# EAGLE design main (EAGLE 9.6.2)
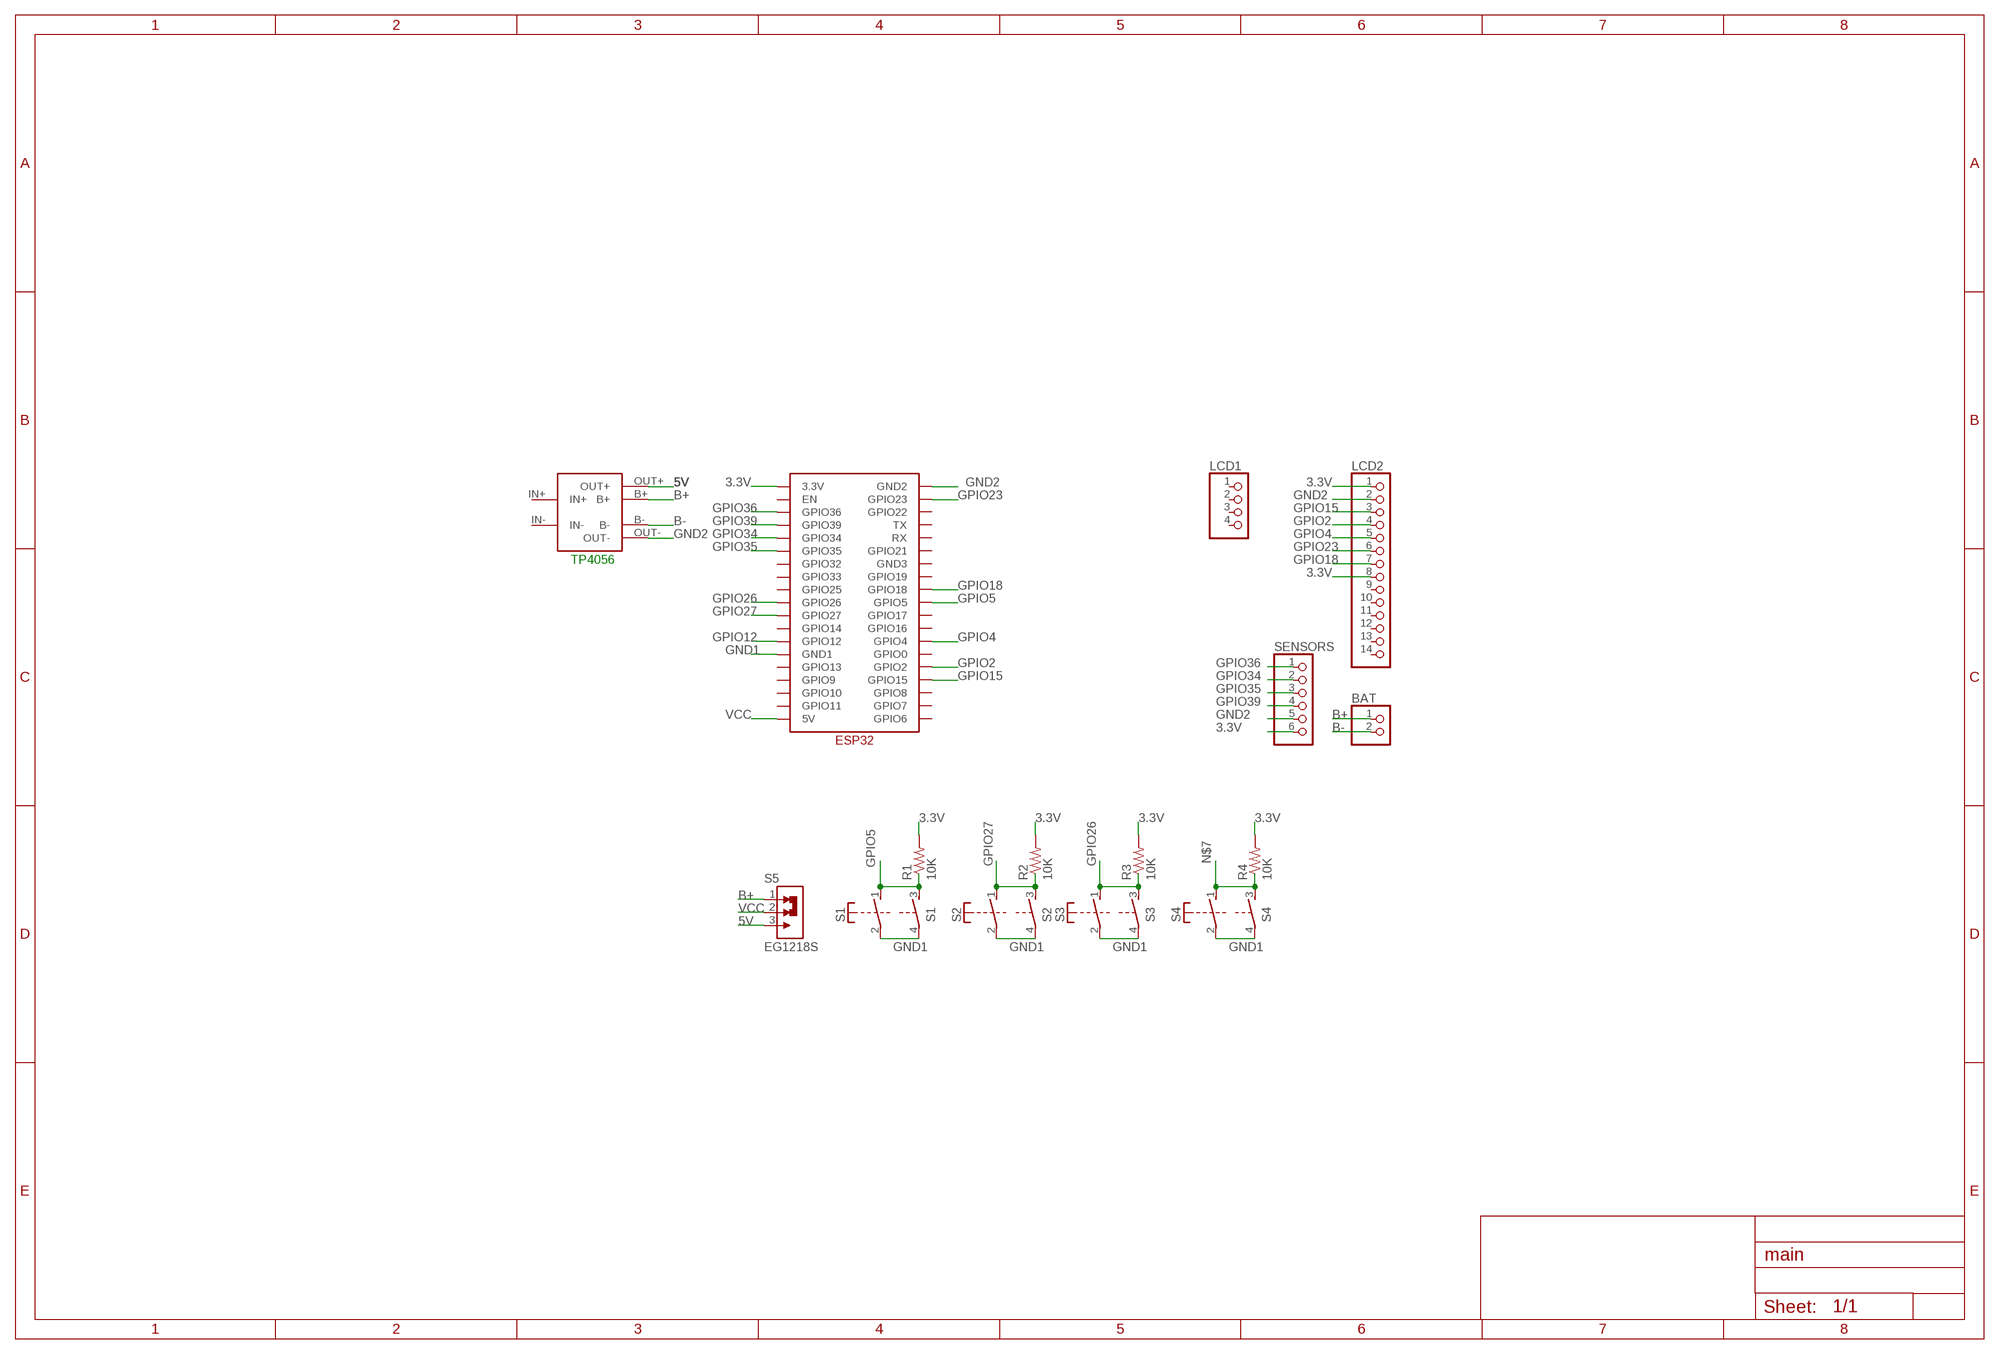
[diagram p0: schematic, sheet 1]

## Parts
BAT  PINHD-1X2  [1X02]
LCD1  PINHD-1X4  [1X04]
LCD2  PINHD-1X14  [1X14]
R1  10K  R-US_R0603  [R0603]
R2  10K  R-US_R0603  [R0603]
R3  10K  R-US_R0603  [R0603]
R4  10K  R-US_R0603  [R0603]
S1  PVA1  [PVA1F]
S2  PVA1  [PVA1F]
S3  PVA1  [PVA1F]
S4  PVA1  [PVA1F]
S5  EG1218S  [SW_EG1218]
SENSORS  PINHD-1X6  [1X06]
U$1  TP4056-PTH  [TP4056-PTH]
U$2  ESP32  [ESP32]

## Nets
3.3V: LCD2.1 LCD2.8 R1.2 R2.2 R3.2 R4.2 SENSORS.6 U$2.3.3V
5V: S5.3(NO) U$1.OUT+
B+: BAT.1 S5.1(NC) U$1.B+
B-: BAT.2 U$1.B-
GND1: S1.2(1:P) S1.4(2:P) U$2.GND1
GND2: LCD2.2 SENSORS.5 U$1.OUT- U$2.GND2
GPIO2: LCD2.4 U$2.GPIO2
GPIO4: LCD2.5 U$2.GPIO4
GPIO5: R1.1 S1.1(1:S) S1.3(2:S) U$2.GPIO5
GPIO12: U$2.GPIO12
GPIO15: LCD2.3 U$2.GPIO15
GPIO18: LCD2.7 U$2.GPIO18
GPIO23: LCD2.6 U$2.GPIO23
GPIO26: R3.1 S3.1(1:S) S3.3(2:S) U$2.GPIO26
GPIO27: R2.1 S2.1(1:S) S2.3(2:S) U$2.GPIO27
GPIO34: SENSORS.2 U$2.GPIO34
GPIO35: SENSORS.3 U$2.GPIO35
GPIO36: SENSORS.1 U$2.GPIO36
GPIO39: SENSORS.4 U$2.GPIO39
N$2: S2.2(1:P) S2.4(2:P)
N$3: S3.2(1:P) S3.4(2:P)
N$4: S4.2(1:P) S4.4(2:P)
N$7: R4.1 S4.1(1:S) S4.3(2:S)
VCC: S5.2(COM) U$2.5V
Unconnected: LCD1.1 LCD1.2 LCD1.3 LCD1.4 LCD2.9 LCD2.10 LCD2.11 LCD2.12 LCD2.13 LCD2.14 U$1.IN+ U$1.IN- U$2.EN U$2.GND3 U$2.GPIO0 U$2.GPIO6 U$2.GPIO7 U$2.GPIO8 U$2.GPIO9 U$2.GPIO10 U$2.GPIO11 U$2.GPIO13 U$2.GPIO14 U$2.GPIO16 U$2.GPIO17 U$2.GPIO19 U$2.GPIO21 U$2.GPIO22 U$2.GPIO25 U$2.GPIO32 U$2.GPIO33 U$2.RX U$2.TX

## Notes on the sheet
- TP4056

## Library data of the parts
BAT = pinhead:PINHD-1X2: PIN HEADER
LCD1 = pinhead:PINHD-1X4: PIN HEADER
LCD2 = pinhead:PINHD-1X14: PIN HEADER
R1-R4 = rcl:R-US_: RESISTOR, American symbol; SPICEPREFIX: R
S1-S4 = switch-misc:PVA1: ITT SWITCH
S5 = EG1218:EG1218; AVAILABILITY: In Stock; DESCRIPTION: Slide Switch SPDT Through Hole; MF: E-Switch; MP: EG1218; PACKAGE: None; PRICE: None; PURCHASE-URL: https://pricing.snapeda.com/search/part/EG1218/?ref=eda
SENSORS = pinhead:PINHD-1X6: PIN HEADER
U$1 = 32teeth - TP4056 Module:TP4056-PTH
U$2 = ESP32:ESP32

## Board
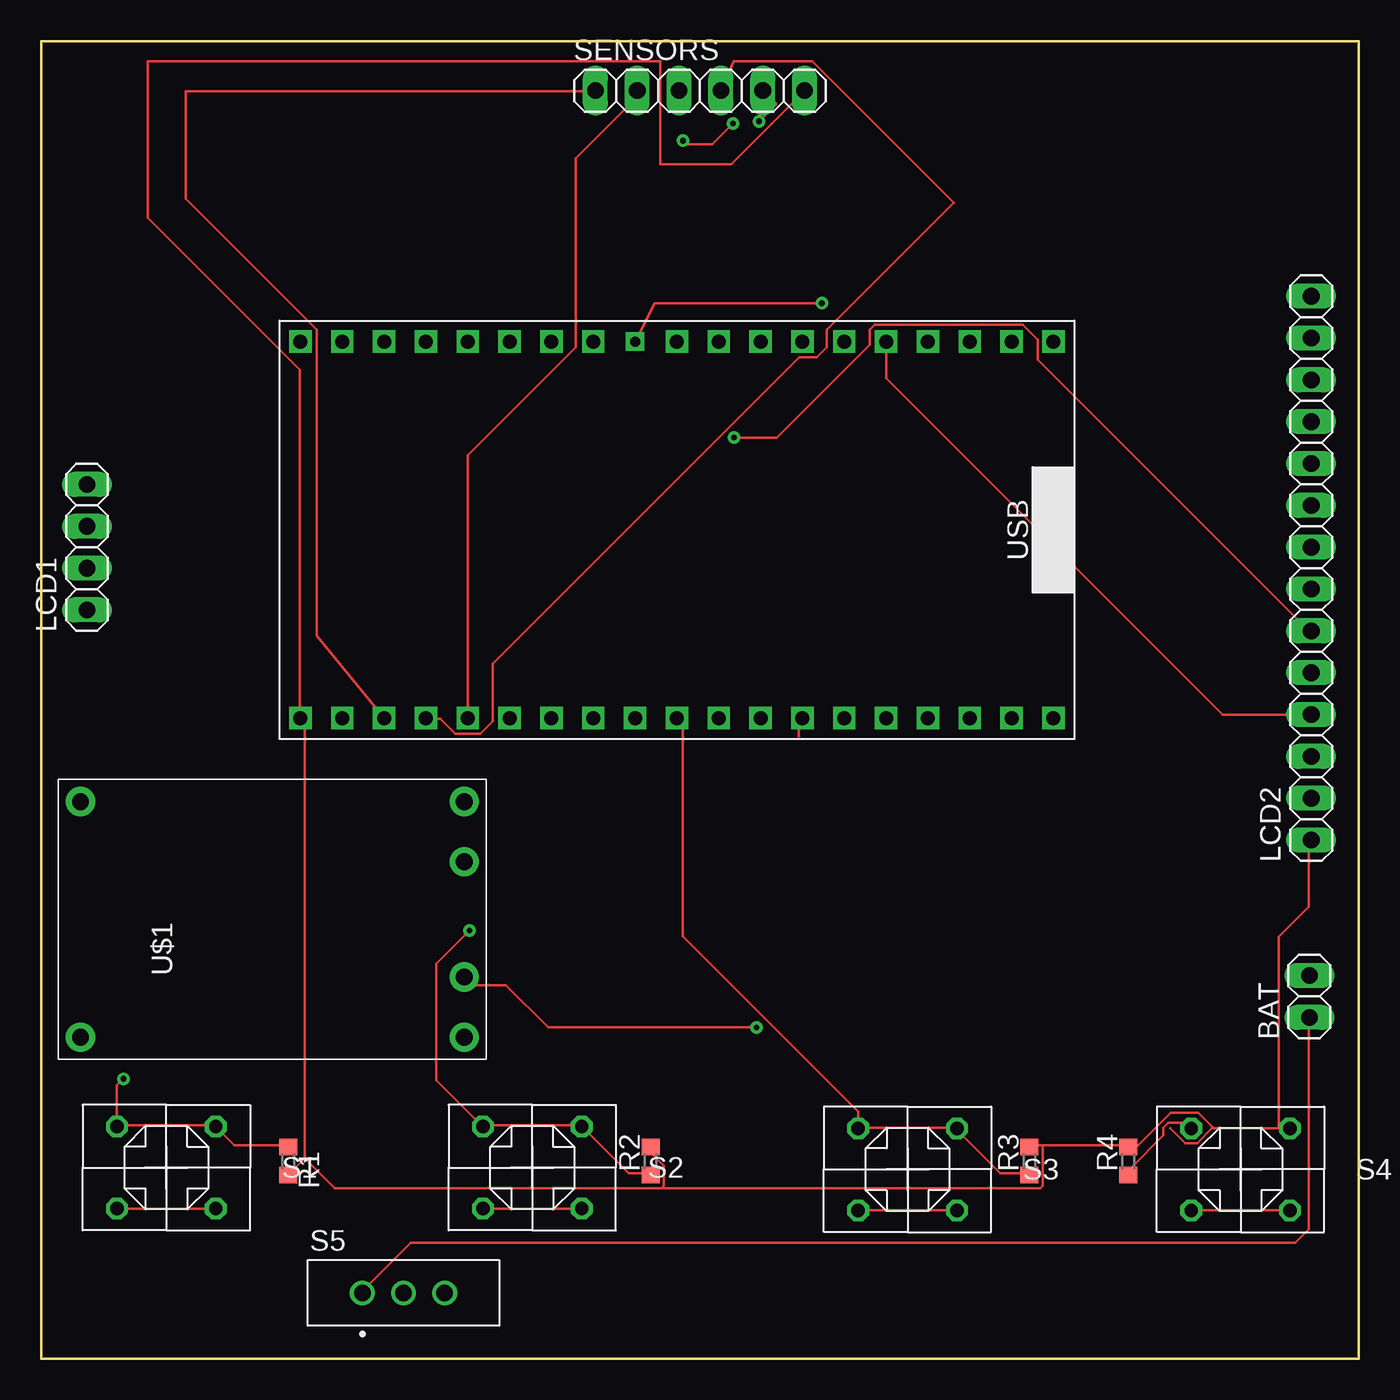
[diagram p1: board, top side]
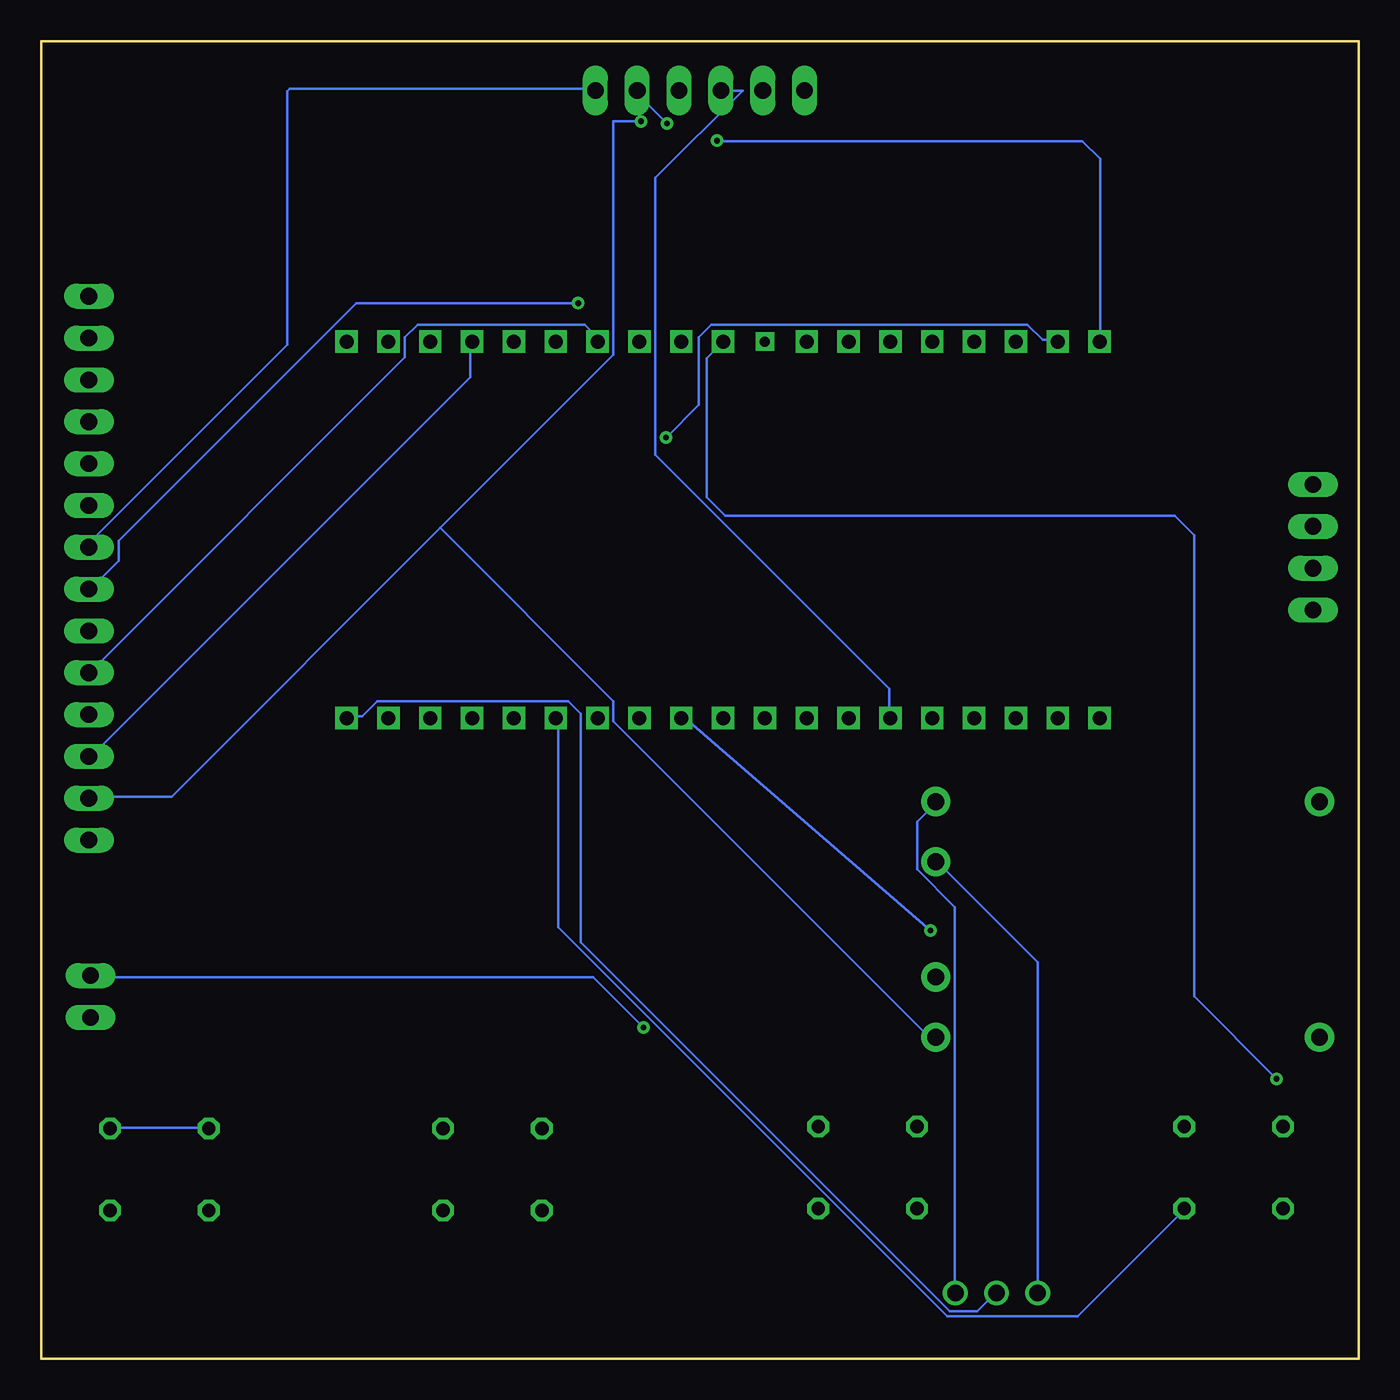
[diagram p2: board, bottom side, seen from below]

Size 80 x 80 mm. Coordinates in mm from the lower left corner, seen from the top.
Outline: 0,80 80,80 80,0 0,0 0,80
Copper layers (1*16): Top 0.035mm / dielectric 1.5mm / Bottom 0.035mm
Design rules "default": minimum track width 6mil, minimum drill 0.35mm, track to track 6mil, track to pad 6mil, pad to pad 6mil, via to via 6mil, smd to smd 6mil, copper to edge 40mil, drill to drill 6mil, minimum pad ring 10mil, minimum via ring 8mil, stop-mask expansion 4mil, vias tented up to drill 0mil, thermal gap 10mil

### Footprints (pad centres in the part's own frame; a part is rotated, then mirrored left to right if it is on the bottom)
1X02 = drill 1.016 long: 1 -1.27,0; 2 1.27,0
1X04 = drill 1.016 long: 1 -3.81,0; 2 -1.27,0; 3 1.27,0; 4 3.81,0
1X14 = drill 1.016 long: 1 -16.51,0; 2 -13.97,0; 3 -11.43,0; 4 -8.89,0; 5 -6.35,0; 6 -3.81,0; 7 -1.27,0; 8 1.27,0; 9 3.81,0; 10 6.35,0; 11 8.89,0; 12 11.43,0; 13 13.97,0; 14 16.51,0
R0603 = smd 1 x 1.1: 1 -0.85,0; 2 0.85,0
PVA1F = drill 0.813 octagon: 1 -2.997,2.489; 2 -2.997,-2.489; 3 2.997,2.489; 4 2.997,-2.489
SW_EG1218 = drill 1: 1 -2.5,0; 2 0,0; 3 2.5,0
1X06 = drill 1.016 long: 1 -6.35,0; 2 -3.81,0; 3 -1.27,0; 4 1.27,0; 5 3.81,0; 6 6.35,0
TP4056-PTH = drill 1.016 pad 1.778: B+ 12,1.35; B- 5,1.35; IN+ 15.65,24.65; IN- 1.35,24.65; OUT+ 15.65,1.35; OUT- 1.35,1.35
ESP32 = drill 0.85 square: 3.3V 1.27,46.99; 5V 1.27,1.27; EN 1.27,44.45; GND1 1.27,13.97; GND2 24.13,46.99; GND3 24.13,31.75; GPIO0 24.13,13.97; GPIO2 24.13,11.43; GPIO4 24.13,16.51; GPIO5 24.13,24.13; GPIO6 24.13,1.27; GPIO7 24.13,3.81; GPIO8 24.13,6.35; GPIO9 1.27,8.89; GPIO10 1.27,6.35; GPIO11 1.27,3.81; GPIO12 1.27,16.51; GPIO13 1.27,11.43; GPIO14 1.27,19.05; GPIO15 24.13,8.89; GPIO16 24.13,19.05; GPIO17 24.13,21.59; GPIO19 24.13,29.21; GPIO21 24.13,34.29; GPIO22 24.13,41.91; GPIO23 24.13,44.45; GPIO25 1.27,26.67; GPIO26 1.27,24.13; GPIO27 1.27,21.59; GPIO32 1.27,31.75; GPIO33 1.27,29.21; GPIO34 1.27,36.83; GPIO35 1.27,34.29; GPIO36 1.27,41.91; GPIO39 1.27,39.37; RX 24.13,36.83; TX 24.13,39.37 | drill 0.6 square: GPIO18 24.13,26.67

### Placement (x,y rotation side)
BAT  77,22 90 top
LCD1  2.78,49.28 90 top
LCD2  77.11,48.01 90 top
R1  15,12 270 top
R2  37,12 90 top
R3  60,12 90 top
R4  66,12 90 top
S1  7.6,11.61 0 top
S2  29.82,11.61 0 top
S3  52.6,11.5 0 top
S4  72.82,11.5 0 top
S5  22,4 0 top
SENSORS  40,77 0 top
U$1  27.03,18.18 90 top
U$2  62.73,37.63 90 top

### Tracks (layer width: path | path; a pad name or v marks a point on that pad's centre or on a via)
3.3V
  Top 0.152: 71.17,13.99 71.08,13.99 70.19,13.1 69.45,13.1 68.57,13.99 | 71.17,13.99 75.13,13.99 75.13,25.62 76.96,27.45 76.96,31.39 LCD2.1 | SENSORS.6 44.35,75 44.35,74.98 41.89,72.52 37.6,72.52 37.6,78.79 6.48,78.79 6.48,69.27 15.7,60.05 15.7,39.01 U$2.3.3V 16,38.81 16,19.51 16,19.5 16,12.19 | 60.81,12.95 65.99,12.95 R4.2 66.14,12.95 66.6,12.95 68.58,14.94 70.26,14.94 71.17,14.02 71.17,13.99 | 60.81,12.95 60.05,12.95 R3.2 | 16,12.19 15.09,11.28 R1.2 | 37.64,10.36 37.8,10.52 37.8,11.73 37.03,12.5 37.03,12.8 R2.2 | 37.64,10.36 17.83,10.36 16,12.19 | 60.81,12.95 60.81,10.52 60.66,10.36 37.64,10.36
  Bottom 0.152: LCD2.8 76.96,49.38 76.96,49.68 65.08,61.57 65.08,76.96 64.92,77.11 46.5,77.11 SENSORS.6
5V
  Bottom 0.152: S5.3 24.54,4.12 24.54,27.43 26.82,29.72 26.82,32.61 25.76,33.68 U$1.OUT+
B+
  Top 0.152: BAT.1 76.96,20.73 76.96,7.87 76.15,7.06 22.45,7.06 19.51,4.12 S5.1
  Bottom 0.152: S5.1 19.51,4.12 19.51,24.08 25.6,30.18 U$1.B+
B-  (via drill 0.35)
  Top 0.152: v43.43,20.12 30.79,20.12 28.21,22.69 26.17,22.69 U$1.B-
  Bottom 0.152: v43.43,20.12 46.48,23.16 76.96,23.16 BAT.2
GND1
  Top 0.152: S1.2 S1.4
  Bottom 0.152: U$2.GND1 48.62,38.86 48.62,26.21 24.99,2.59 17.07,2.59 10.67,8.99 S1.4
GND2  (via drill 0.35)
  Top 0.152: v43.59,75.13 44.59,76.13 44.59,76.22 SENSORS.5 | v38.96,73.96 39.18,73.75 40.75,73.75 v42,75
  Bottom 0.152: U$2.GND2 15.7,61.87 15.7,72.85 16.78,73.93 38.93,73.93 v38.96,73.96 | 55.78,50.44 45.26,60.96 45.26,75.13 v43.59,75.13 | 55.78,50.44 72.08,34.14 76.96,34.14 LCD2.2 | 55.78,50.44 45.26,39.93 45.26,38.71 26.21,19.66 25.76,19.66 U$1.OUT- | SENSORS.5 43.81,76.81 v42,75
GPIO2
  Top 0.152: U$2.GPIO2 51.3,59.54 71.73,39.12 LCD2.4
GPIO4
  Bottom 0.152: U$2.GPIO4 46.22,62 47.01,62.79 57.15,62.79 57.91,62.03 57.91,60.81 76.96,41.76 LCD2.5
GPIO5  (via drill 0.35)
  Top 0.152: v5,17 4.6,16.6 S1.1 4.72,14.17 10.52,14.17 S1.3 10.67,14.02 11.73,12.95 14.94,12.95 R1.1
  Bottom 0.152: v5,17 10,22 10,50 11.18,51.18 38.48,51.18 39.6,52.3 39.6,60.76 U$2.GPIO5
GPIO12
  Top 0.152: 46,37.81 46,38.68 U$2.GPIO12
GPIO15
  Bottom 0.152: U$2.GPIO15 53.95,61.72 53.95,59.59 76.96,36.58 LCD2.3
GPIO18  (via drill 0.35)
  Top 0.152: v47.4,64.09 37.26,64.09 U$2.GPIO18
  Bottom 0.152: v47.4,64.09 60.87,64.09 75.29,49.68 75.29,48.46 76.96,46.79 LCD2.7
GPIO23  (via drill 0.35)
  Top 0.152: v42.06,55.93 44.65,55.93 50.29,61.57 50.29,62.48 50.6,62.79 59.59,62.79 60.5,61.87 60.5,60.66 76.96,44.2 LCD2.6
  Bottom 0.152: v42.06,55.93 40.08,57.91 40.08,62.03 39.32,62.79 20.12,62.79 19.2,61.87 18.29,61.87 U$2.GPIO23
GPIO26
  Top 0.152: U$2.GPIO26 38.94,38.56 38.94,25.65 49.6,14.99 S3.1 49.68,14.02 55.47,14.02 S3.3 55.63,13.87 58.22,11.28 59.89,11.28 R3.1
GPIO27  (via drill 0.35)
  Top 0.152: v26,26 24,24 24,16.92 S2.1 26.98,14.17 32.77,14.17 S2.3 32.92,14.02 35.66,11.28 36.88,11.28 R2.1
  Bottom 0.152: U$2.GPIO27 40.9,38.9 v26,26
GPIO34
  Top 0.152: SENSORS.2 36.19,76.62 32.46,72.89 32.46,61.42 25.91,54.86 25.91,39.01 U$2.GPIO34
GPIO35
  Bottom 0.152: U$2.GPIO35 28.5,39.01 28.5,40.69 42.71,54.9 42.71,71.71 37.41,77 SENSORS.3
GPIO36
  Top 0.152: U$2.GPIO36 16.73,43.9 16.73,62.47 8.76,70.43 8.76,76.96 33.55,76.96 SENSORS.1
GPIO39
  Top 0.152: U$2.GPIO39 23.47,38.86 24.23,38.86 25.15,37.95 26.67,37.95 27.43,38.71 27.43,42.22 46.02,60.81 47.09,60.81 47.7,61.42 47.7,62.48 55.41,70.19 46.81,78.79 42.04,78.79 SENSORS.4
N$2
  Top 0.152: S2.2 S2.4
N$3
  Top 0.152: S3.2 S3.4
N$4
  Top 0.152: S4.2 S4.4
N$7
  Top 0.152: R4.1 66.14,11.28 66.14,11.58 68.12,13.56 68.12,14.02 68.43,14.33 69.49,14.33 69.8,14.02 S4.1
  Bottom 0.152: S4.3 75.74,14.02 69.95,14.02 S4.1
VCC
  Bottom 0.152: U$2.5V 61.42,39.01 60.5,39.01 59.59,39.93 48.01,39.93 47.24,39.17 47.24,25.3 24.84,2.9 23.16,2.9 22.1,3.96 S5.2